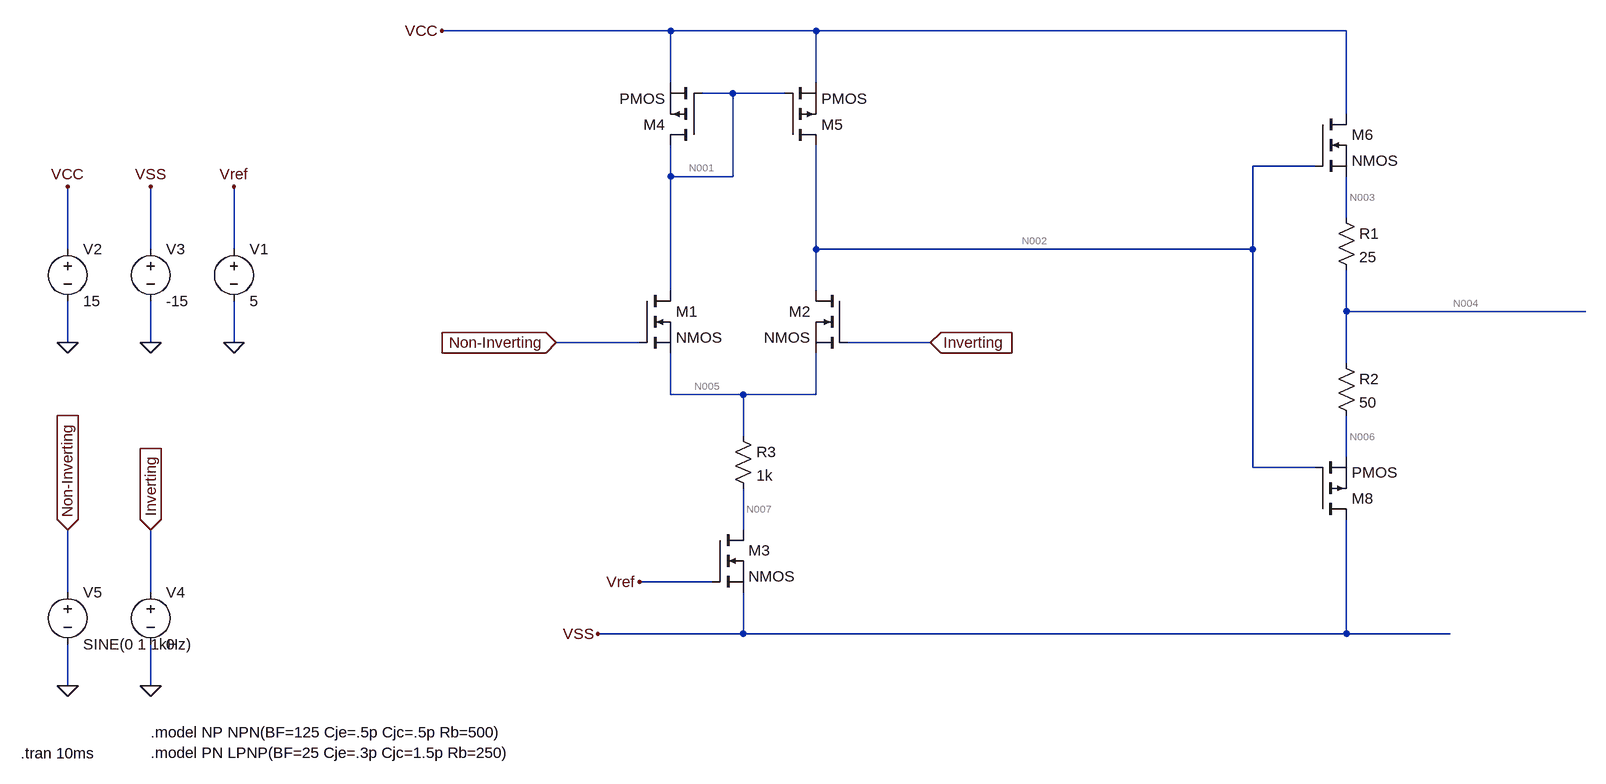
[diagram p0: schematic m_Opamp_VLSI_MOS.asc]
m_Opamp_VLSI_MOS.asc, the LTspice schematic file:
Version 4
SHEET 1 880 868
WIRE -1472 -544 -1824 -544
WIRE -1248 -544 -1472 -544
WIRE -432 -544 -1248 -544
WIRE -1472 -464 -1472 -544
WIRE -1248 -464 -1248 -544
WIRE -1376 -448 -1424 -448
WIRE -1296 -448 -1376 -448
WIRE -432 -416 -432 -544
WIRE -480 -336 -576 -336
WIRE -1472 -320 -1472 -368
WIRE -1376 -320 -1376 -448
WIRE -1376 -320 -1472 -320
WIRE -432 -256 -432 -320
WIRE -2400 -208 -2400 -304
WIRE -2272 -208 -2272 -304
WIRE -2144 -208 -2144 -304
WIRE -1248 -208 -1248 -368
WIRE -576 -208 -576 -336
WIRE -576 -208 -1248 -208
WIRE -1472 -144 -1472 -320
WIRE -1248 -144 -1248 -208
WIRE -432 -112 -432 -176
WIRE -64 -112 -432 -112
WIRE -2400 -64 -2400 -128
WIRE -2272 -64 -2272 -128
WIRE -2144 -64 -2144 -128
WIRE -1520 -64 -1648 -64
WIRE -1072 -64 -1200 -64
WIRE -432 -32 -432 -112
WIRE -1472 16 -1472 -48
WIRE -1360 16 -1472 16
WIRE -1248 16 -1248 -48
WIRE -1248 16 -1360 16
WIRE -1360 80 -1360 16
WIRE -432 112 -432 48
WIRE -576 128 -576 -208
WIRE -480 128 -576 128
WIRE -1360 224 -1360 160
WIRE -1408 304 -1520 304
WIRE -2400 320 -2400 224
WIRE -2272 320 -2272 224
WIRE -1360 384 -1360 320
WIRE -1360 384 -1584 384
WIRE -432 384 -432 208
WIRE -432 384 -1360 384
WIRE -272 384 -432 384
WIRE -2400 464 -2400 400
WIRE -2272 464 -2272 400
FLAG -1648 -64 Non-Inverting
IOPIN -1648 -64 In
FLAG -1072 -64 Inverting
IOPIN -1072 -64 In
FLAG -2144 -64 0
FLAG -2144 -304 Vref
FLAG -1520 304 Vref
FLAG -2272 -64 0
FLAG -2400 -64 0
FLAG -2400 -304 VCC
FLAG -2272 -304 VSS
FLAG -1824 -544 VCC
FLAG -2272 464 0
FLAG -2400 464 0
FLAG -2400 224 Non-Inverting
IOPIN -2400 224 In
FLAG -2272 224 Inverting
IOPIN -2272 224 In
FLAG -1584 384 VSS
SYMBOL voltage -2144 -224 R0
SYMATTR InstName V1
SYMATTR Value 5
SYMBOL voltage -2400 -224 R0
SYMATTR InstName V2
SYMATTR Value 15
SYMBOL voltage -2272 -224 R0
WINDOW 123 0 0 Left 0
WINDOW 39 0 0 Left 0
SYMATTR InstName V3
SYMATTR Value -15
SYMBOL voltage -2272 304 R0
SYMATTR InstName V4
SYMATTR Value 0
SYMBOL voltage -2400 304 R0
WINDOW 123 0 0 Left 0
WINDOW 39 0 0 Left 0
SYMATTR InstName V5
SYMATTR Value SINE(0 1 1kHz)
SYMBOL res -448 -272 R0
SYMATTR InstName R1
SYMATTR Value 25
SYMBOL res -448 -48 R0
SYMATTR InstName R2
SYMATTR Value 50
SYMBOL res -1376 64 R0
SYMATTR InstName R3
SYMATTR Value 1k
SYMBOL nmos -1520 -144 R0
SYMATTR InstName M1
SYMBOL nmos -1200 -144 M0
SYMATTR InstName M2
SYMBOL nmos -1408 224 R0
SYMATTR InstName M3
SYMBOL pmos -1424 -368 R180
SYMATTR InstName M4
SYMBOL pmos -1296 -368 M180
SYMATTR InstName M5
SYMBOL nmos -480 -416 R0
SYMATTR InstName M6
SYMBOL pmos -480 208 M180
SYMATTR InstName M8
TEXT -2272 536 Left 2 !.model NP NPN(BF=125 Cje=.5p Cjc=.5p Rb=500)\n.model PN LPNP(BF=25 Cje=.3p Cjc=1.5p Rb=250)
TEXT -2472 568 Left 2 !.tran 10ms

The netlist it stands for:
* m_Opamp_VLSI_MOS.asc
V1 Vref 0 5
V2 VCC 0 15
V3 VSS 0 -15
V4 Inverting 0 0
V5 Non-Inverting 0 SINE(0 1 1kHz)
R1 N003 N004 25
R2 N004 N006 50
R3 N005 N007 1k
M1 N001 Non-Inverting N005 N005 NMOS
M2 N002 Inverting N005 N005 NMOS
M3 N007 Vref VSS VSS NMOS
M4 N001 N001 VCC VCC PMOS
M5 N002 N001 VCC VCC PMOS
M6 VCC N002 N003 N003 NMOS
M8 VSS N002 N006 N006 PMOS
.model NMOS NMOS
.model PMOS PMOS
.lib standard.mos
.model NP NPN(BF=125 Cje=.5p Cjc=.5p Rb=500)
.model PN LPNP(BF=25 Cje=.3p Cjc=1.5p Rb=250)
.tran 10ms
.backanno
.end

* Results of the author's LTspice run, read from the files saved beside the schematic
* Operating Point, zero values left out:
*   V(vref) = 5 V
*   V(vcc) = 15 V
*   V(vss) = -15 V
*   V(n003) = 6.072 V
*   V(n004) = 6.072 V
*   V(n006) = 6.072 V
*   V(n005) = -8.923 V
*   V(n007) = -10.52 V
*   V(n001) = 6.077 V
*   V(n002) = 6.077 V
*   Id(M1) = 796.3 µA
*   Ib(M1) = -15.01 pA
*   Is(M1) = -796.3 µA
*   Id(M2) = 796.3 µA
*   Ib(M2) = -15.01 pA
*   Is(M2) = -796.3 µA
*   Id(M3) = 1.593 mA
*   Ib(M3) = -4.494 pA
*   Is(M3) = -1.593 mA
*   Id(M6) = 186.9 pA
*   Ib(M6) = -8.938 pA
*   Is(M6) = -178 pA
*   Id(M4) = -796.3 µA
*   Ib(M4) = 8.933 pA
*   Is(M4) = 796.3 µA
*   Id(M5) = -796.3 µA
*   Ib(M5) = 8.933 pA
*   Is(M5) = 796.3 µA
*   Id(M8) = -42.15 pA
*   Ib(M8) = 21.08 pA
*   Is(M8) = 21.07 pA
*   I(R1) = 42.15 pA
*   I(R2) = 42.15 pA
*   I(R3) = 1.593 mA
*   I(V2) = -1.593 mA
*   I(V3) = 1.593 mA
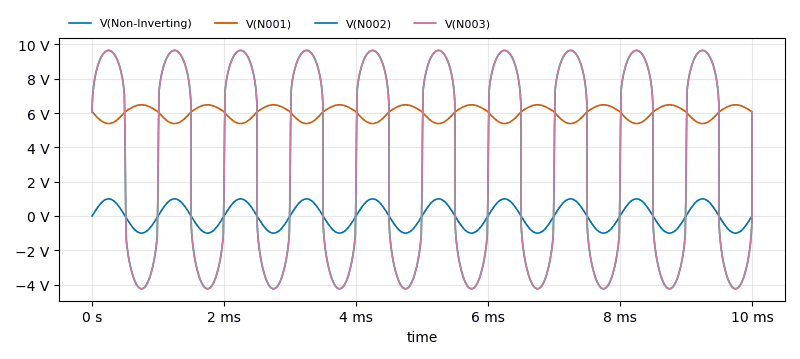
[diagram p1: Transient Analysis of m_Opamp_VLSI_MOS.asc, plotted from the saved traces]
* Transient Analysis, 1 run:
*   V(Non-Inverting): min -999.9 mV, max 1 V, average -32.78 µV, rms 706.8 mV, last 0 V
*   V(N001): min 5.388 V, max 6.483 V, average 5.986 V, rms 5.998 V, last 6.077 V
*   V(N002): min -4.244 V, max 9.655 V, average 2.81 V, rms 6.719 V, last 6.077 V
*   V(N003): min -4.243 V, max 9.653 V, average 2.81 V, rms 6.717 V, last 6.07 V